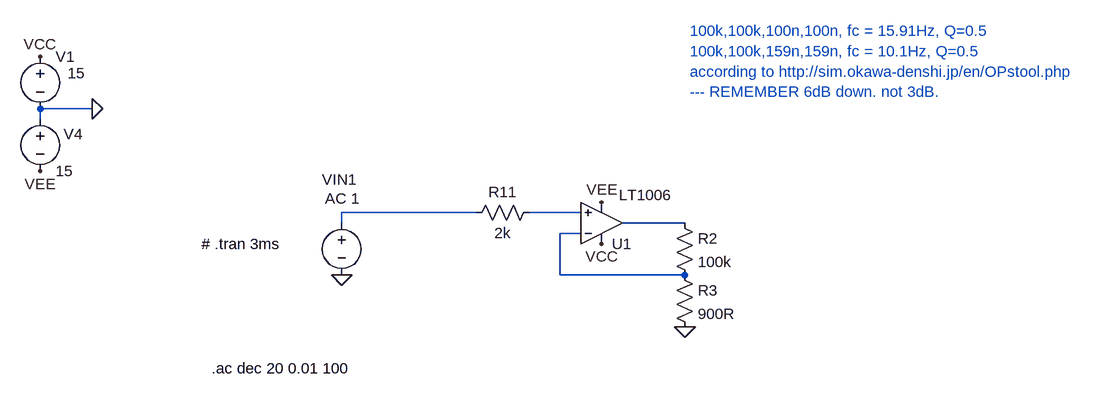
[diagram p0: schematic Draft02.asc]
Draft02.asc, the LTspice schematic file:
Version 4
SHEET 1 2756 2104
WIRE -672 -544 -752 -544
WIRE -752 -528 -752 -544
WIRE -80 -384 -288 -384
WIRE 80 -384 0 -384
WIRE -288 -368 -288 -384
WIRE 240 -368 144 -368
WIRE 80 -352 48 -352
WIRE 48 -288 48 -352
WIRE 240 -288 48 -288
FLAG -752 -624 VCC
FLAG -752 -448 VEE
FLAG 112 -336 VCC
FLAG 112 -400 VEE
FLAG -672 -544 0
FLAG 240 -208 0
FLAG -288 -288 0
SYMBOL voltage -752 -640 R0
WINDOW 123 0 0 Left 0
WINDOW 39 0 0 Left 0
WINDOW 3 42 41 Left 2
SYMATTR Value 15
SYMATTR InstName V1
SYMBOL voltage -752 -544 R0
WINDOW 123 0 0 Left 0
WINDOW 39 0 0 Left 0
WINDOW 0 36 39 Left 2
SYMATTR InstName V4
SYMATTR Value 15
SYMBOL res -96 -368 R270
WINDOW 0 32 56 VTop 2
WINDOW 3 0 56 VBottom 2
SYMATTR InstName R11
SYMATTR Value 2k
SYMBOL OpAmps\\LT1006 112 -304 M180
WINDOW 3 27 107 Left 2
SYMATTR InstName U1
SYMBOL voltage -288 -384 R0
WINDOW 123 -26 -22 Left 2
WINDOW 39 0 0 Left 0
WINDOW 3 -341 151 Left 2
WINDOW 0 -30 -51 Left 2
SYMATTR Value2 AC 1
SYMATTR Value ""
SYMATTR InstName VIN1
SYMBOL res 224 -384 R0
SYMATTR InstName R2
SYMATTR Value 100k
SYMBOL res 224 -304 R0
SYMATTR InstName R3
SYMATTR Value 900R
TEXT -504 -336 Left 2 !# .tran 3ms
TEXT -488 -144 Left 2 !.ac dec 20 0.01 100
TEXT 248 -664 Left 2 ;100k,100k,100n,100n, fc = 15.91Hz, Q=0.5\n100k,100k,159n,159n, fc = 10.1Hz, Q=0.5\naccording to http://sim.okawa-denshi.jp/en/OPstool.php\n--- REMEMBER 6dB down. not 3dB.

The netlist it stands for:
* Draft02.asc
V1 VCC 0 15
V4 0 VEE 15
R11 N001 N002 2k
XU1 N002 N004 VCC VEE N003 LT1006  ; pins In+ In- V+ V- OUT
VIN1 N001 0 AC 1
R2 N003 N004 100k
R3 N004 0 900R
# .tran 3ms
.ac dec 20 0.01 100
* 100k,100k,100n,100n, fc = 15.91Hz, Q=0.5
* 100k,100k,159n,159n, fc = 10.1Hz, Q=0.5
* according to http://sim.okawa-denshi.jp/en/OPstool.php
* --- REMEMBER 6dB down. not 3dB.
.lib LTC.lib
.backanno
.end